# Altium project PERfECT-PRO2.PrjPcb
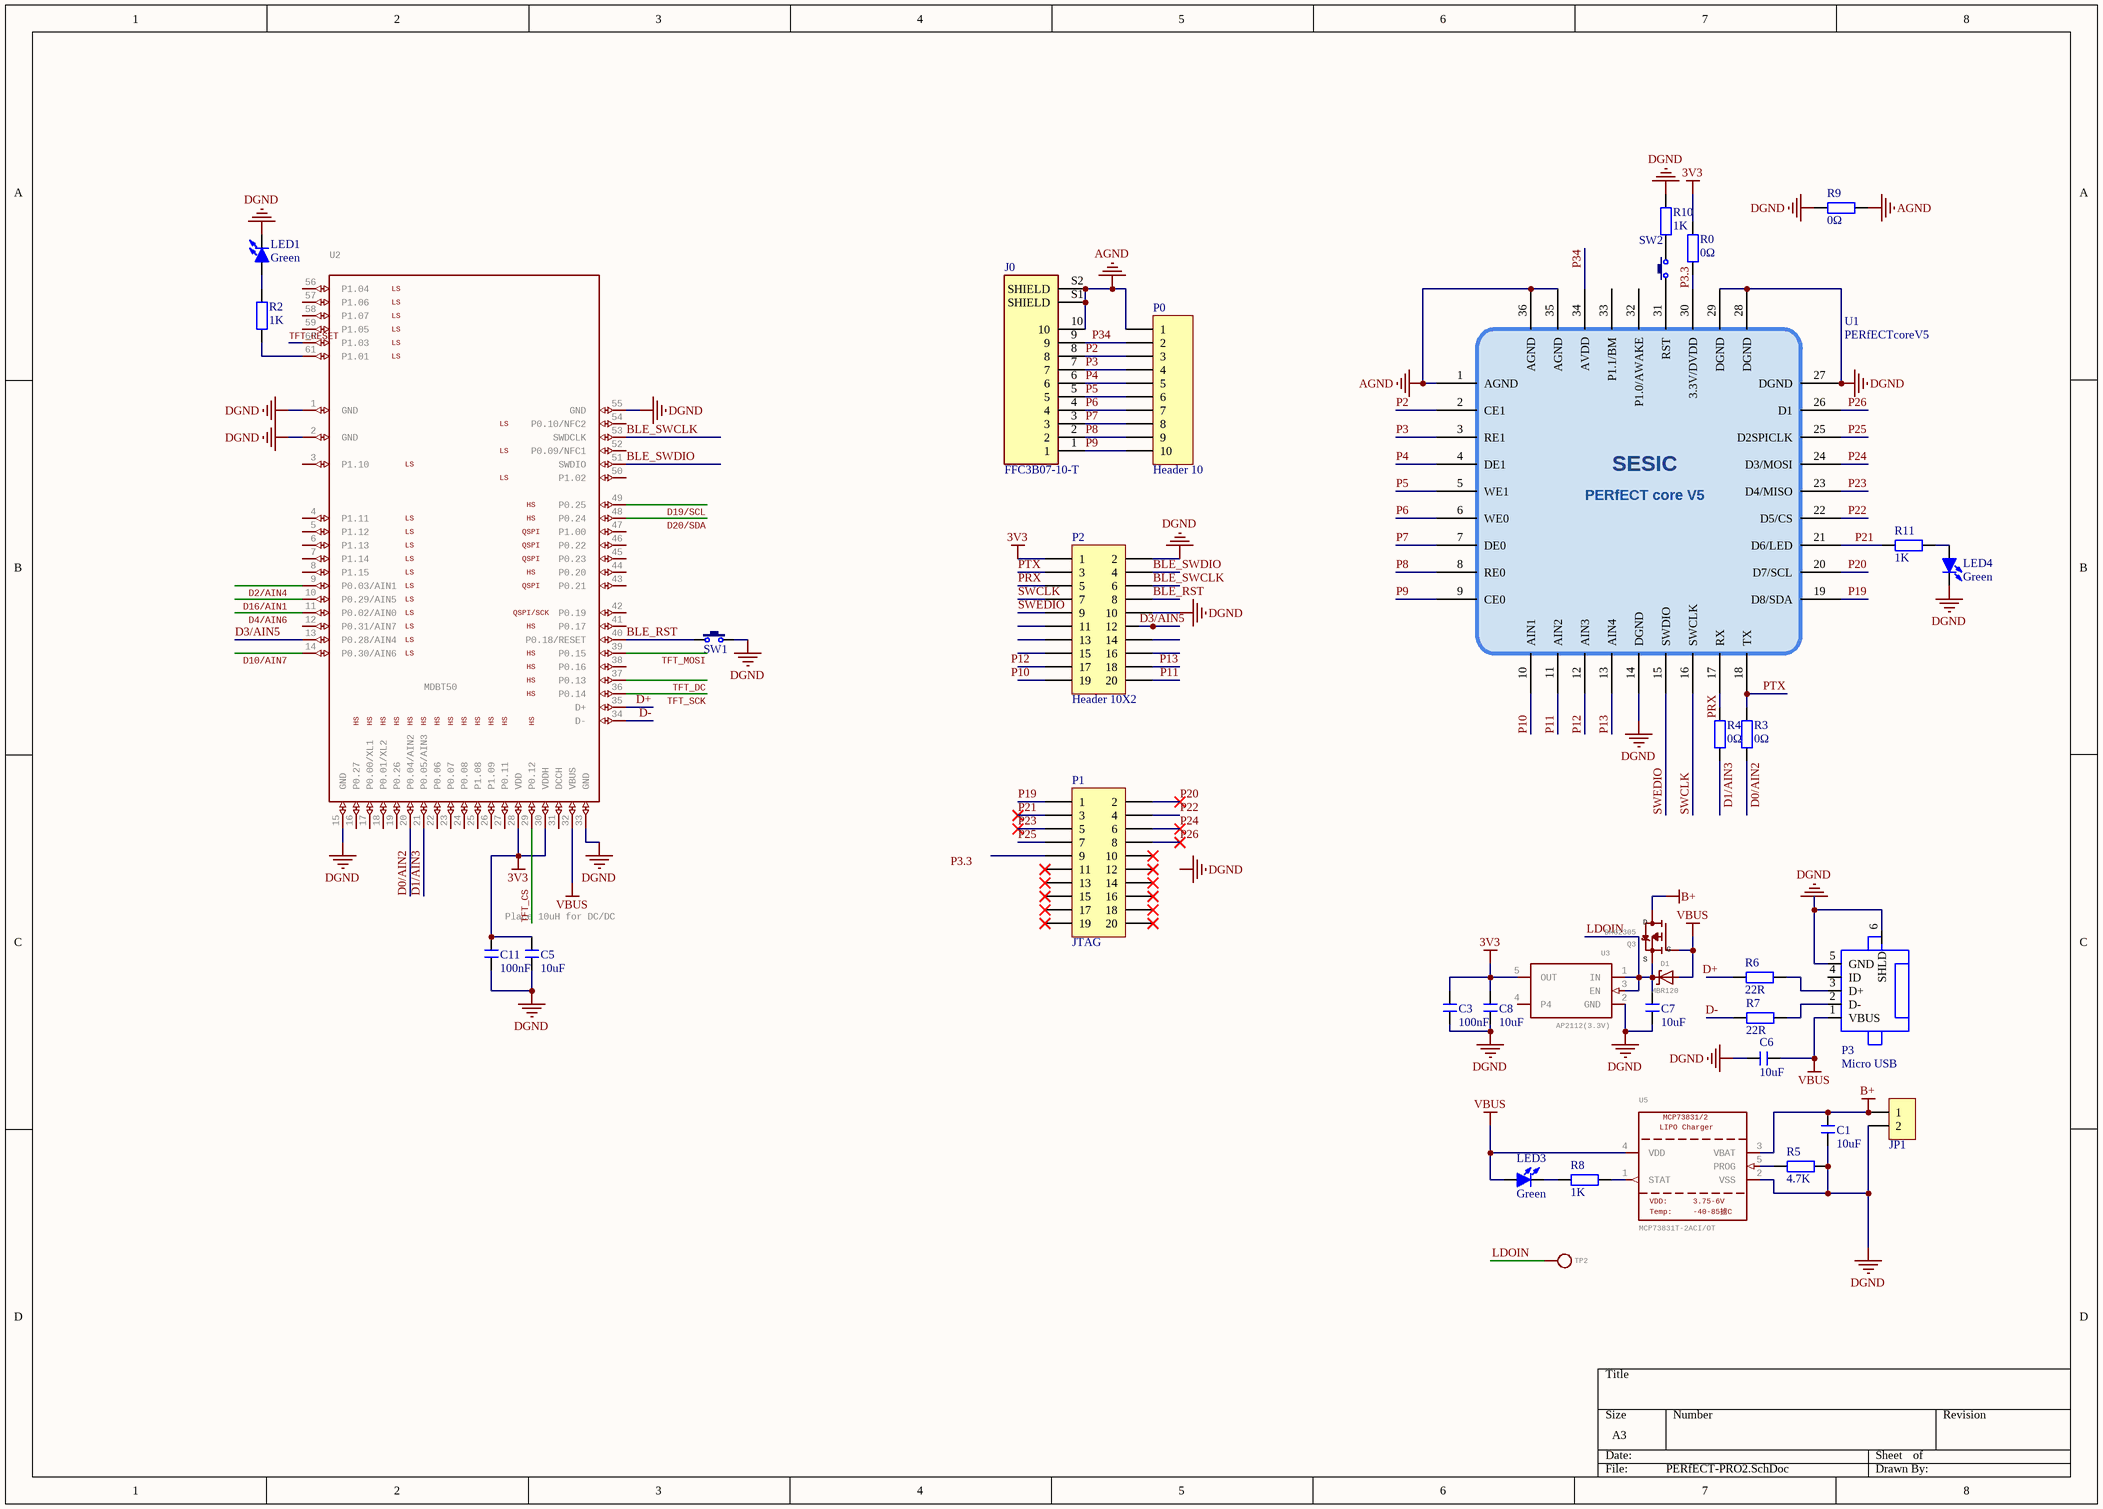
[diagram p0: PERfECT-PRO2.SchDoc]
1 sheet, 36 parts. Net scope: global (net labels, ports and power ports of the same name join across sheets).
Board file: PERfECT-PRO2.PcbDoc

## Sheet PERfECT-PRO2.SchDoc
size A3

### Parts
C1  10uF  [LC-0603_C]
C3  100nF  [LC-0603_C]
C5  10uF  [LC-0603_C]
C6  10uF  [LC-0603_C]
C7  10uF  [LC-0603_C]
C8  10uF  [LC-0603_C]
C11  100nF  [LC-0603_C]
D1  MBR120  [LC-SOD-123]
J0  FFC3B07-10-T  [GCT_FFC3B07-10-T]
JP1  HDR-1X2  [XH2.54-LI-2P]  (value not drawn)
LED1  Green  [LC-0603_LED_S1]
LED3  Green  [0603_LED_S1]
LED4  Green  [LC-0603_LED_S1]
P0  Header 10  [HDR1X10]
P1  JTAG  [HDR2X10]
P2  Header 10X2  [HDR2X10]
P3  Micro USB  [1981584-1]
Q3  DMG2305  [LC-SOT-23-3L]
R0  0Ω  [LC-0603_R]
R2  1K  [LC-0603_R]
R3  0Ω  [0603_R]
R4  0Ω  [0603_R]
R5  4.7K  [LC-0603_R]
R6  22R  [LC-0603_R]
R7  22R  [LC-0603_R]
R8  1K  [0603_R]
R9  0Ω  [LC-0603_R]
R10  1K  [LC-0603_R]
R11  1K  [LC-0603_R]
SW1  3x6x5  [TSW SMD-3*6*2.5]  (value not drawn)
SW2  3x6x5  [TSW SMD-3*6*2.5]  (value not drawn)
TP2  TESTPOINTROUND1.5MM  [TESTPOINT_ROUND_1.5MM]  (value not drawn)
U1  PERfECTcoreV5  [PERfECTcore36]
U2  MDBT50  [MDBT50]
U3  AP2112(3.3V)  [SOT23-5]
U5  MCP73831T-2ACI/OT  LIPOCharger: LIPO Charger  Temp: Temp:  VDD: VDD:  [SOT23-5]

### Nets
3V3: C3.2 C5.2 C8.2 C11.2 P2.1 R0.1 U2.28(VDD) U2.30(VDDH) U3.5(OUT)
AGND: J0.10 J0.S1(SHIELD) J0.S2(SHIELD) P0.1 R9.2 U1.1(AGND) U1.35(AGND) U1.36(AGND)
B+: C1.2 JP1.1 Q3.3(D) U5.3(VBAT)
DGND: C1.1 C3.1 C5.1 C6.2 C7.1 C8.1 C11.1 JP1.2 LED1.2(K) LED4.2(K) P2.2 P2.10 P3.5(GND) P3.6(SHLD) R5.2 R9.1 R10.2 SW1.2 U1.14(DGND) U1.27(DGND) U1.28(DGND) U1.29(DGND) U2.1(GND) U2.2(GND) U2.15(GND) U2.33(GND) U2.55(GND) U3.2(GND) U5.2(VSS)
VBUS: C6.1 D1.A LED3.1(A) P3.1(VBUS) Q3.1(G) U2.32(VBUS) U5.4(VDD)
BLE_RST: P2.8 SW1.1 U2.40(P0.18/RESET)
BLE_SWCLK: P2.6 U2.53(SWDCLK)
BLE_SWDIO: P2.4 U2.51(SWDIO)
D0/AIN2: R3.2 U2.20(P0.04/AIN2)
D1/AIN3: R4.2 U2.21(P0.05/AIN3)
D2/AIN4: U2.9(P0.03/AIN1)
D3/AIN5: P2.12 U2.13(P0.28/AIN4)
D4/AIN6: U2.11(P0.02/AIN0)
D10/AIN7: U2.14(P0.30/AIN6)
D16/AIN1: U2.10(P0.29/AIN5)
D19/SCL: U2.49(P0.25)
D20/SDA: U2.48(P0.24)
D+: R6.1 U2.35(D+)
D-: R7.1 U2.34(D-)
LDOIN: C7.2 D1.C Q3.2(S) TP2.P$1 U3.1(IN) U3.3(EN)
P2: J0.8 P0.3 U1.2(CE1)
P3: J0.7 P0.4 U1.3(RE1)
P3.3: R0.2 U1.30(3.3V/DVDD)
P4: J0.6 P0.5 U1.4(DE1)
P5: J0.5 P0.6 U1.5(WE1)
P6: J0.4 P0.7 U1.6(WE0)
P7: J0.3 P0.8 U1.7(DE0)
P8: J0.2 P0.9 U1.8(RE0)
P9: J0.1 P0.10 U1.9(CE0)
P10: P2.19 U1.10(AIN1)
P11: P2.20 U1.11(AIN2)
P12: P2.17 U1.12(AIN3)
P13: P2.18 U1.13(AIN4)
P19: P1.1 U1.19(D8/SDA)
P20: P1.2 U1.20(D7/SCL)
P21: P1.3 R11.1 U1.21(D6/LED)
P22: P1.4 U1.22(D5/CS)
P23: P1.5 U1.23(D4/MISO)
P24: P1.6 U1.24(D3/MOSI)
P25: P1.7 U1.25(D2SPICLK)
P26: P1.8 U1.26(D1)
P34: J0.9 P0.2 U1.34(AVDD)
PRX: P2.5 R4.1 U1.17(RX)
PTX: P2.3 R3.1 U1.18(TX)
SWCLK: P2.7 U1.16(SWCLK)
SWEDIO: P2.9 U1.15(SWDIO)
TFT_CS: U2.29(P0.12)
TFT_DC: U2.37(P0.13)
TFT_MOSI: U2.39(P0.15)
TFT_RESET: U2.60(P1.03)
TFT_SCK: U2.36(P0.14)
NetLED1_1: LED1.1(A) R2.2
NetLED3_2: LED3.2(K) R8.1
NetLED4_1: LED4.1(A) R11.2
NetP3_2: P3.2(D-) R7.2
NetP3_3: P3.3(D+) R6.2
NetR2_1: R2.1 U2.61(P1.01)
NetR5_1: R5.1 U5.5(PROG)
NetR8_2: R8.2 U5.1(STAT)
NetR10_1: R10.1 SW2.2
NetSW2_1: SW2.1 U1.31(RST)

Not connected (* = marked no-connect by the designer): P1 9 10* 11* 12* 13* 14* 15* 16* 17* 18* 19* 20*; P2 11 13 14 15 16; P3 4(ID); U1 32(P1.0/AWAKE) 33(P1.1/BM); U2 3(P1.10) 4(P1.11) 5(P1.12) 6(P1.13) 7(P1.14) 8(P1.15) 12(P0.31/AIN7) 16(P0.27) 17(P0.00/XL1) 18(P0.01/XL2) 19(P0.26) 22(P0.06) 23(P0.07) 24(P0.08) 25(P1.08) 26(P1.09) 27(P0.11) 31(DCCH) 38(P0.16) 41(P0.17) 42(P0.19) 43(P0.21) 44(P0.20) 45(P0.23) 46(P0.22) 47(P1.00) 50(P1.02) 52(P0.09/NFC1) 54(P0.10/NFC2) 56(P1.04) 57(P1.06) 58(P1.07) 59(P1.05); U3 4(P4)

### Notes on the sheet
- Place 10uH for DC/DC
- Labels drawn without touching a wire or pin: DGND, P3.3
- (in symbol PERfECTcoreV5) SESIC; PERfECT core V5

### Library data of the parts
C1 C3 C5-C8 C11 = C: 无极性贴片电容; 版权归属: 源创客; BOM名称: 无极性贴片电容; 学习资源: www.ooocke.com
D1 = DIODE-SCHOTTKYSOD-123: pin to pad: A>1 C>2; GateName_1: G$1; SymbolName_1: DIODE-SCHOTTKY; DeviceName: SOD-123; LibraryName: microbuilder; DeviceSetName: DIODE-SCHOTTKY
J0 = FFC3B07-10-T: 10 Position FFC, FPC Connector Contacts, Bottom 0.039 (1.00mm) Surface Mount, Right Angle; MF: Global Connector Technology; Value: *; SnapEDA_Link: https://www.snapeda.com/parts/FFC3B07-10-T/Global%20Connector%20Technology/view-part/4223038/?ref=snap; DigiKey-Purchase-URL: https://snapeda.com/shop?store=DigiKey&id=4223038; Package: Package; MP: FFC3B07-10-T; Availability: Warning; Price: None; BuyPart: https://www.snapeda.com/parts/FFC3B07-10-T/Global%20Connector%20Technology/view-part/4223038/?ref=eda
JP1 = Header 2: 2P接插件; 版权归属: 源创客; BOM名称: 2P接插件; 学习资源: www.ooocke.com
LED1 LED3 LED4 = LED-SMD: 贴片LED; pin to pad: 1>A 2>K; 版权归属: 源创客; BOM名称: 贴片LED; 学习资源: www.ooocke.com
P0 = Header 10: Header, 10-Pin; LatestRevisionDate: 17-Jul-2002; LatestRevisionNote: Re-released for DXP Platform.; Publisher: Altium Limited
P1 P2 = Header 10X2: Header, 10-Pin, Dual row; LatestRevisionDate: 17-Jul-2002; LatestRevisionNote: Re-released for DXP Platform.; Publisher: Altium Limited
P3 = 1981584-1: CONN RCPT MICRO USB TYPE AB; Manufacturer: REG CON; PartNumber: C21377; Vendor: LCSC; Value: Micro USB
Q3 = MOSFET-P: P-Channel Mosfet   LEGEND   VDS: Voltage Drain-Source ID: Drain Current RDS(ON): Drain-Source On-State Resistance VGS(TH): Gate-Source Threshold Voltage CISS: Drain-Source Input Capacitance    SOT-23   Name	VDS	ID	RDS(ON)	VGS(TH)	CISS	Order Number	   IRLML5103	30V	760mA	600 mOhm	--	75pF @ 25V	Digikey: IRLML5103PBFCT-ND	   IRLML6401	12V	4.3A	50 mOhm	950mV @ 250碌A	830pF @ 10V	Digikey: IRLML6401PBFTR-ND	   NTR0202PL	20V	400mA	800 mOhm	2.3V @ 250uA	70pF @ 5V	Digikey: NTR0202PLT1GOSTR-ND	   NTR4101PT1G	20V	1.8A	85 mOhm	1.2V @ 250uA	675pF @ 10V	Digikey: NTR4101PT1GOSCT-ND	   DMP2004K	20V	600mA	900 mOhm	1V @ 250uA	175pF @ 16V	Digikey: DMP2004KDICT-ND	   PMV65XP	20V	3.9A	76 mOhm	950mV @ 1mA	725pF @ 20V	Digikey: 568-2358-2-ND	   							   							TO-252   Name	VDS	ID	RDS(ON)	VGS(TH)	CISS	Order Number	   AOD417	30V	25A	34 mOhm	3V @ 250碌A	920pF @ 15V	Digikey: 785-1106-2-ND	PowerPak   Name	VDS	ID	RDS(ON)	VGS(TH)	CISS	Order Number	   AON7401	30V	12A	14 mOhm	3V @ 250碌A	2600pF @ 15V	Digikey: 785-1302-1-ND; GateName_1: G$1; SymbolName_1: MOSFET-P; LibraryName: microbuilder; DeviceSetName: MOSFET-P; D: D; S: S; G: G
R0 R2-R11 = R: 贴片电阻; 版权归属: 源创客; BOM名称: 贴片电阻; 学习资源: www.ooocke.com
SW1 SW2 = TSW 3x6: 3x6轻触开关; 版权归属: 源创客; BOM名称: 3x6轻触开关; 学习资源: www.ooocke.com
TP2 = TESTPOINTROUND1.5MM: Test Point   Various test points for characterisation and PCB testing    TESTPOINT_SMT - Compact Surface Mount Test Point [Digikey: 5016KTR-ND]; GateName_1: G$1; SymbolName_1: TESTPOINT; DeviceName: ROUND1.5MM; LibraryName: microbuilder; DeviceSetName: TESTPOINT
U1 = PERfECTcoreV5: This is the 5th version of PERfEC core.https://github.com/WISE-PERfECT/PERfECT
U2 = MDBT50: Raytac Corporation   MDBT50  Bluetooth Low Energy Module based on Noridc nRF52840    Source:  Raytac datasheet; GateName_1: G$1; SymbolName_1: MDBT50; LibraryName: microbuilder; DeviceSetName: MDBT50; LS: LS; HS: HS; QSPI: QSPI; QSPI/SCK: QSPI/SCK
U3 = VREG_SOT23-5: SOT23-5 Fixed Voltage Regulators      Part	Current Out	V Out	V In	V Dropout	胃JA (掳C/W)	TJ (掳C)	Digikey Part No.	     ADP121	  150mA	  3.3V	  3.4-5.5V	  0.09V @ 150mA	  --	  --	  ADP121-AUJZ33R7CT-ND	     ADP121	  150mA	  3.0V	  3.1-5.5V	  0.09V @ 150mA	  --	  --	  ADP121-AUJZ30R7CT-ND	     ADP122	  300mA	  3.3V	  3.4-5.5V	  0.085V @ 300mA	  --	  --	  ADP122AUJZ-3.3-R7CT-ND	     ADP1712	  300mA	  3.3V	  3.5-5.5V	  0.17V @ 300mA	  --	  --	  ADP1712AUJZ-3.3-R7TR-ND	     AP7311 (Low Cost)	  150mA	  3.3V	  3.5-6V	  0.15V @ 150mA	  --	  --	  AP7311-33WG-7DICT-ND	     LD39015M18R	  150mA	  1.8V	  1.9V-5.5V	  0.08V @ 100mA	  --	  --	  497-6977-1-ND	     LP2985A-33DBVR	  150mA	  3.3V	  3.3-16V	  0.28V @ 150mA	  206	  150	  296-18479-1-ND	     MCP1824T-3302E/OT	  300mA	  3.3V	  3.5V-6V	  0.2V @ 300mA	  --	  --	  MCP1824T-3302E/OTCT-ND	     MIC5205-2.5YM5 TR	  150mA	  2.5V	  2.7-16V	  0.165V @ 150mA	  --	  --	  576-1257-2-ND	     MIC5205-3.0YM5 TR	  150mA	  3.0V	  3.2V-16V	  0.165V @ 150mA	  --	  --	  576-1258-2-ND	     MIC5205-3.3YM5 TR	  150mA	  3.3V	  3.5V-16V	  0.165V @ 150mA	  --	  --	  576-1259-2-ND	     TPS780330220	  150mA	  3.3V+2.2V	  3.6-5.5V	  250mV Max	  --	  --	  296-23332-1-ND	     TDA3663/N1,135	  100mA	  3.3V	  3.5-45V	  0.18V @ 50mA	  --	  --	  568-5343-1-ND	     	  	  	  	  	  	  	  	     	  	  	  	  	  	  	  	   Max operating temp can be calculated using 胃JA, TJ (max junction temperature), and power in watts.  Set the "Maximum Ambient Temperature" until it reaches TJ ("Max Junction Temperature"), which is the absolute limit for safe use of the regulator: Heat Sink Temperature Calculator   For example, With 12V source into a 3.3V LP2985 and a 30mA load, we are dissipating (12V-3.3V) * 0.03A = 0.261W.  With a 胃JA of 206 掳C/W, a TJ of 150掳C, and 261mW we can safely use the chip without a heat sink up to 75掳C (=147.1掳C Junction Temperature).; GateName_1: G$1; SymbolName_1: VREG_SOT23-5; LibraryName: microbuilder; DeviceSetName: VREG_SOT23-5
U5 = MCP73831/2: MCP73831/2 LIPO Charger    VDD: 3.75 - 6V  Temp -40 - 85掳C  Programmable Charge Rate: 15-500mA       NOTE: STAT is a tri-state logic output on the MCP73831 and an open-drain output on the MCP73832.   SOT23-5 with 4.2V output and tri-state logic on STAT = MCP73831T-2ACI/OT; GateName_1: G$1; SymbolName_1: MCP73831/2; LibraryName: microbuilder; DeviceSetName: MCP73831/2; MCP73831/2: MCP73831/2; -40-85掳C: -40-85掳C; 3.75-6V: 3.75-6V